# EAGLE design mdriver_v2 (EAGLE 9.6.2)
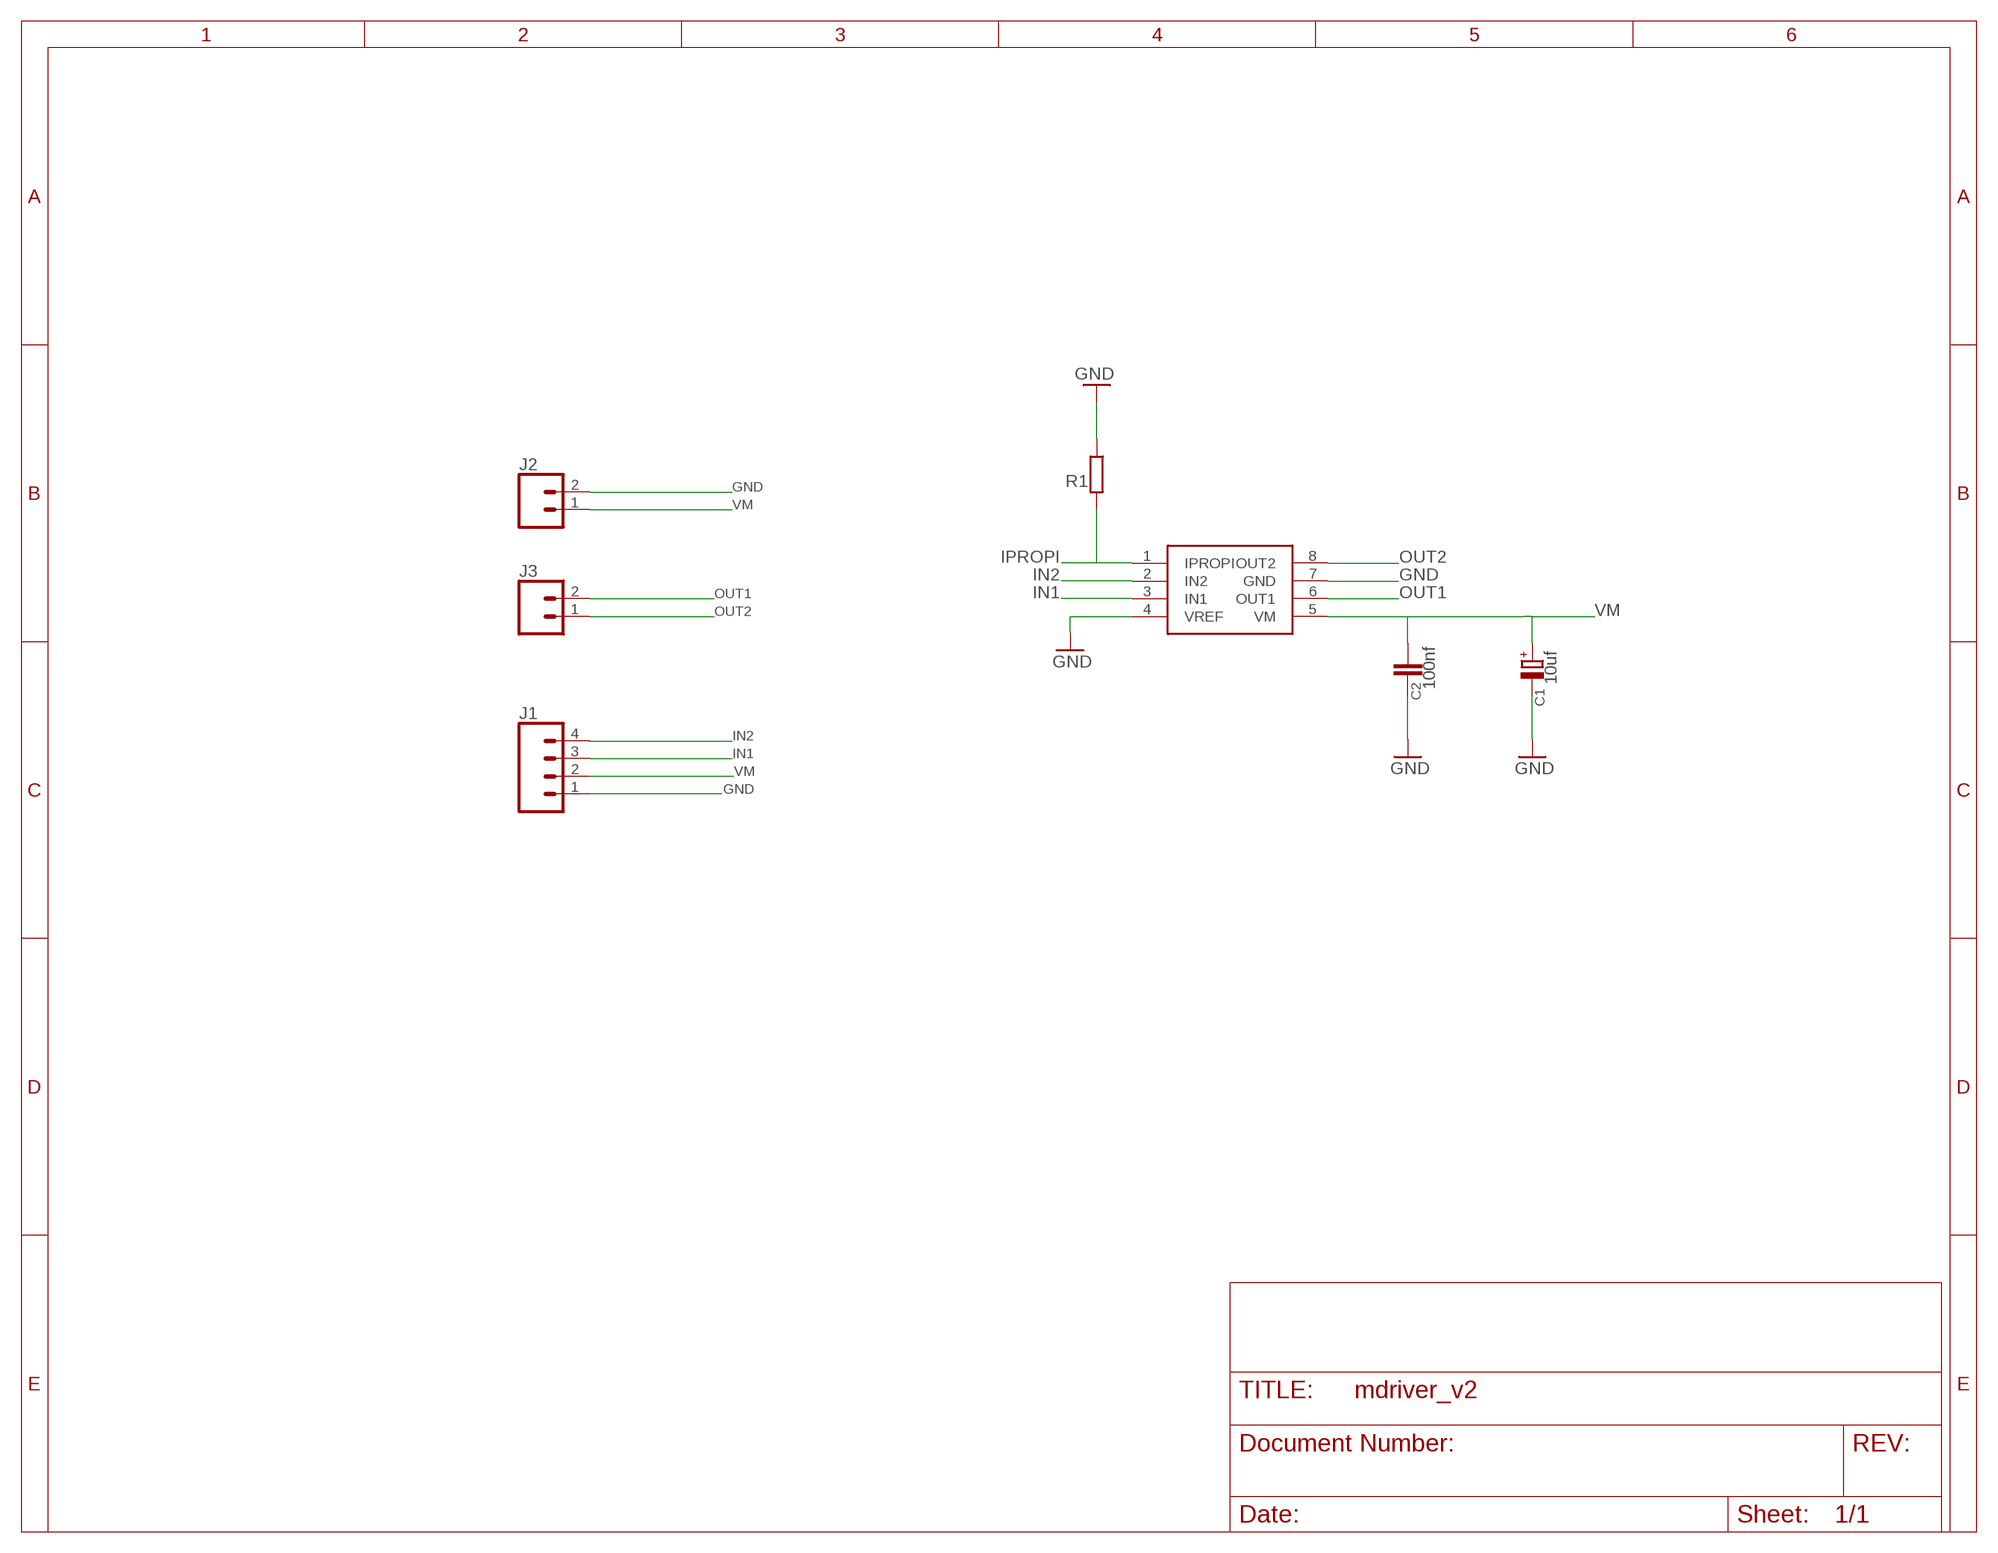
[diagram p0: schematic, sheet 1]

## Parts
C1  10uf  CPOL-EUE2,5-6E  [E2,5-6E]
C2  100nf  C-EU025-025X050  [C025-025X050]
J1  CONN_04  [1X04]
J2  CONN_02  [1X02]
J3  CONN_02  [1X02]
R1  SMK  [SMK]
U$1  DRV8231A  [SOIC127P580X170-9T271X340N]

## Nets
GND: C1.- C2.2 J1.1 J2.2 R1.1 U$1.4(VREF) U$1.7(GND)
IN1: J1.3 U$1.3(IN1)
IN2: J1.4 U$1.2(IN2)
IPROPI: R1.2 U$1.1(IPROPI)
OUT1: J3.2 U$1.6(OUT1)
OUT2: J3.1 U$1.8(OUT2)
VM: C1.+ C2.1 J1.2 J2.1 U$1.5(VM)

## Library data of the parts
C1 = rcl:CPOL-EU: POLARIZED CAPACITOR, European symbol; SPICEPREFIX: C
C2 = rcl:C-EU: CAPACITOR, European symbol; SPICEPREFIX: C
J1 = SparkFun-Connectors:CONN_04: Multi connection point. Often used as Generic Header-pin footprint for 0.1 inch spaced/style header connections On any of the 0.1 inch spaced packages, you can populate with these: Break Away Headers - Straight <https://www.sparkfun.com/products/116> (PRT-00116) Break Away Male Headers - Right Angle <https://www.sparkfun.com/products/553> (PRT-00553) Female Headers <https://www.sparkfun.com/products/115> (PRT-00115) Break Away Headers - Machine Pin <https://www.sparkfun.com/products/117> (PRT-00117) Break Away Female Headers - Swiss Machine Pin <https://www.sparkfun.com/products/743> (PRT-00743) For SCREWTERMINALS and SPRING TERMINALS visit here: Screw Terimnals on SparkFun.com <https://www.sparkfun.com/search/results?term=Screw+Terminals> (5mm/3.5mm/2.54mm spacing) This device is also useful as a general connection point to wire up your design to another part of your project. Our various solder wires solder well into these plated through hole pads. Hook-Up Wire - Assortment (Stranded, 22 AWG) <https://www.sparkfun.com/products/11375> (PRT-11375) Hook-Up Wire - Assortment (Solid Core, 22 AWG) <https://www.sparkfun.com/products/11367> (PRT-11367) View the entire wire category on our website here <https://www.sparkfun.com/categories/141> Special notes: Molex polarized connector foot print use with SKU : PRT-08231 with associated crimp pins and housings. 1MM SMD Version SKU: PRT-10208; PROD_ID: CONN-09696
J2 J3 = SparkFun-Connectors:CONN_02: Multi connection point. Often used as Generic Header-pin footprint for 0.1 inch spaced/style header connections On any of the 0.1 inch spaced packages, you can populate with these: Break Away Headers - Straight <https://www.sparkfun.com/products/116> (PRT-00116) Break Away Male Headers - Right Angle <https://www.sparkfun.com/products/553> (PRT-00553) Female Headers <https://www.sparkfun.com/products/115> (PRT-00115) Break Away Headers - Machine Pin <https://www.sparkfun.com/products/117> (PRT-00117) Break Away Female Headers - Swiss Machine Pin <https://www.sparkfun.com/products/743> (PRT-00743) For SCREWTERMINALS and SPRING TERMINALS visit here: Screw Terimnals on SparkFun.com <https://www.sparkfun.com/search/results?term=Screw+Terminals> (5mm/3.5mm/2.54mm spacing) This device is also useful as a general connection point to wire up your design to another part of your project. Our various solder wires solder well into these plated through hole pads. Hook-Up Wire - Assortment (Stranded, 22 AWG) <https://www.sparkfun.com/products/11375> (PRT-11375) Hook-Up Wire - Assortment (Solid Core, 22 AWG) <https://www.sparkfun.com/products/11367> (PRT-11367) View the entire wire category on our website here <https://www.sparkfun.com/categories/141> Special notes: Molex polarized connector foot print use with: PRT-08233 with associated crimp pins and housings. 2.54_SCREWTERM for use with PRT-10571. 3.5mm Screw Terminal footprints for PRT-08084 5mm Screw Terminal footprints for use with PRT-08432
R1 = resistor-shunt:SMK: SMD SHUNT RESISTOR; OC_FARNELL: unknown; OC_NEWARK: unknown
U$1 = pcb_moible:DRV8231A

## Board
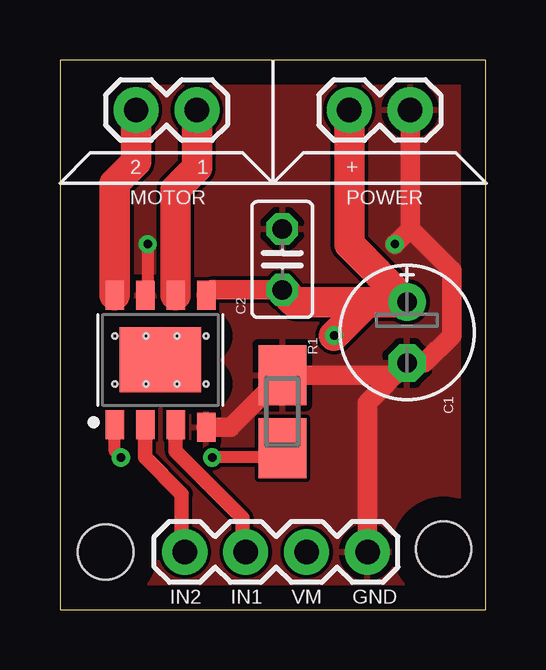
[diagram p1: board, top side]
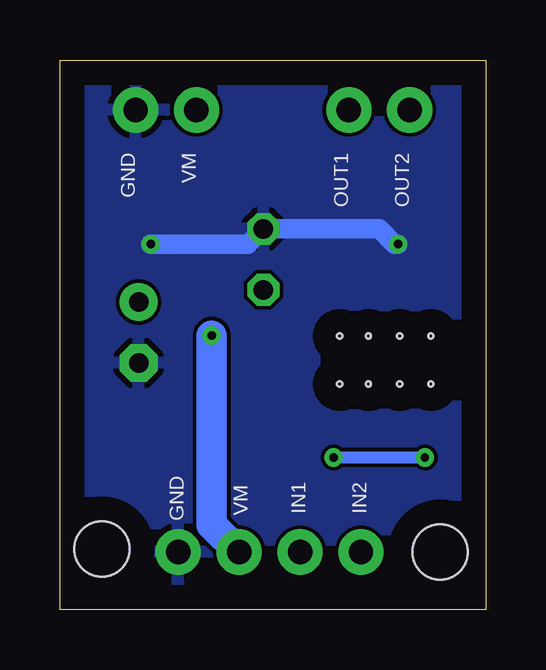
[diagram p2: board, bottom side, seen from below]

Size 17.76 x 22.91 mm. Coordinates in mm from the lower left corner, seen from the top.
Outline: 0,22.91 0,0 17.76,0 17.76,22.91 0,22.91
Copper layers (1*16): Top 0.035mm / dielectric 1.5mm / Bottom 0.035mm
Design rules "default": minimum track width 6mil, minimum drill 0.35mm, track to track 6mil, track to pad 6mil, pad to pad 6mil, via to via 6mil, smd to smd 6mil, copper to edge 40mil, drill to drill 6mil, minimum pad ring 10mil, minimum via ring 8mil, stop-mask expansion 4mil, vias tented up to drill 0mil, thermal gap 10mil
Holes 2.3 mm at 1.91,2.41 16,2.54

### Footprints (pad centres in the part's own frame; a part is rotated, then mirrored left to right if it is on the bottom)
E2,5-6E = drill 0.813 pad 1.575: + -1.27,0 | drill 0.813 pad 1.575 octagon: - 1.27,0
C025-025X050 = drill 0.813 octagon: 1 -1.27,0; 2 1.27,0
1X04 = drill 1.016 pad 1.88: 1 0,0; 2 2.54,0; 3 5.08,0; 4 7.62,0
1X02 = drill 1.016 pad 1.88: 1 0,0; 2 2.54,0
SMK = smd 2.5 x 2: 1 1.524,0; 2 -1.524,0
SOIC127P580X170-9T271X340N = smd 1.212 x 0.772: 1 -2.7,1.905; 2 -2.7,0.635; 3 -2.7,-0.635; 4 -2.8,-1.905; 5 2.7,-1.905; 6 2.7,-0.635; 7 2.7,0.635; 8 2.7,1.905 | smd 2.71 x 3.4: 9 0,0 | hole 0.2: -1,1.9; 1,1.9; 1,0.6; -1,0.6; -1,-0.7; 1,-0.7; 1,-1.9; -1,-1.9

### Placement (x,y rotation side)
C1  14.48,11.56 270 top
C2  9.27,14.61 90 top
J1  12.83,2.41 180 top
J2  12.06,20.83 0 top
J3  3.17,20.83 0 top
R1  9.27,8.26 90 top
U$1  4.19,10.41 90 top

### Tracks (layer width: path | path; a pad name or v marks a point on that pad's centre or on a via)
GND  (via drill 0.35)
  Top 0.508: v3.66,15.24 3.66,13.22 U$1.7
  Top 0.813: J2.2 14.61,15.88 | 14.61,15.88 16.34,14.14 16.34,11.43 15.2,10.29 C1.- | C1.- 13.97,9.78 R1.1 7.11,7.61 U$1.4 | C1.- 12.83,8.64 J1.1 | 14.61,15.88 v13.97,15.24
  Bottom 0.813: v13.97,15.24 9.91,15.24 C2.2 4.45,15.88 3.81,15.24 v3.66,15.24
  pour Top: -3.81,25.4 21.59,25.4 21.59,-2.54 -3.81,-2.54
  pour Bottom: -2.54,24.13 20.32,24.13 20.32,-1.27 19.05,-1.27 -2.54,-1.27
IN1
  Top 0.61: J1.3 7.62,2.54 7.62,3.81 4.83,6.6 U$1.3
IN2
  Top 0.61: U$1.2 3.56,6.35 5.08,4.83 5.08,2.54 J1.4
IPROPI  (via drill 0.35)
  Top 0.508: R1.2 8.89,6.35 v6.35,6.35 | v2.54,6.35 2.29,6.6 U$1.1
  Bottom 0.508: v6.35,6.35 v2.54,6.35
OUT1
  Top 1.27: U$1.6 4.83,17.53 5.71,18.41 J3.2
OUT2
  Top 1.27: U$1.8 2.29,17.78 3.17,18.67 J3.1
VM  (via drill 0.35)
  Top 0.813: C2.1 6.32,13.34 U$1.5
  Top 1.27: J2.1 12.06,15.24 C1.+ 12.7,12.83 | 12.7,12.83 9.78,12.83 C2.1 | 12.7,12.83 12.7,12.7 v11.43,11.43
  Bottom 1.27: v11.43,11.43 11.43,3.56 J1.2

### Text on the board
tPlace: 2 | 1 | + | MOTOR | POWER | IN2 | IN1 | VM | GND
bPlace: OUT2 | OUT1 | VM | GND | GND | IN2 | IN1 | VM